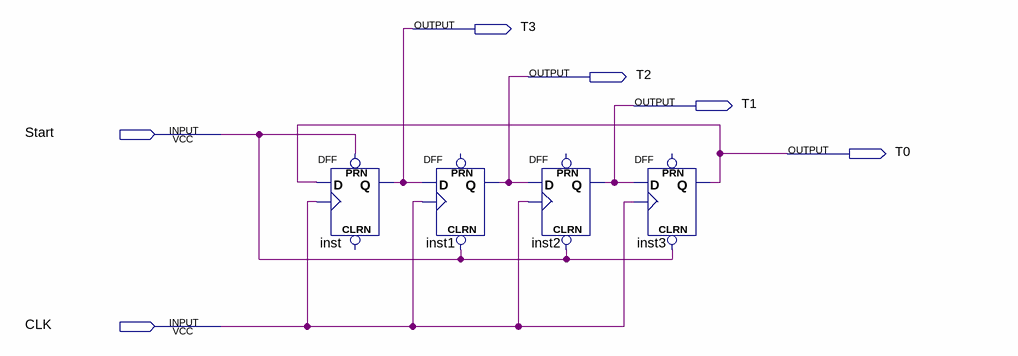
[diagram p0: schematic sheet]
// Quartus schematic Maquina.bdf as structural Verilog: 4 symbols, 6 pins
module Maquina (
  input  Start,
  input  CLK,
  output T3,
  output T2,
  output T1,
  output T0
);

  DFF inst (.CLK(CLK), .D(T0), .PRN(Start), .Q(T3));  // open: CLRN
  DFF inst1 (.CLRN(Start), .CLK(CLK), .D(T3), .Q(T2));  // open: PRN
  DFF inst2 (.CLRN(Start), .CLK(CLK), .D(T2), .Q(T1));  // open: PRN
  DFF inst3 (.CLRN(Start), .CLK(CLK), .D(T1), .Q(T0));  // open: PRN
endmodule
